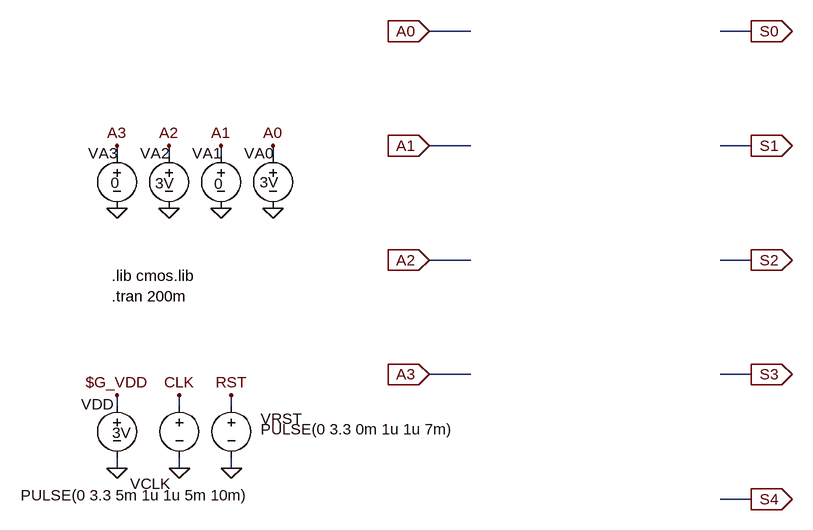
[diagram p0: schematic accumulator.asc]
accumulator.asc, the LTspice schematic file:
Version 4
SHEET 1 1492 1076
WIRE -304 -112 -368 -112
WIRE 128 -112 80 -112
WIRE -304 64 -368 64
WIRE 128 64 80 64
WIRE -848 80 -848 64
WIRE -768 80 -768 64
WIRE -688 80 -688 64
WIRE -608 80 -608 64
WIRE -304 240 -368 240
WIRE 128 240 80 240
WIRE -304 416 -368 416
WIRE 128 416 80 416
WIRE -848 464 -848 448
WIRE -752 464 -752 448
WIRE -672 464 -672 448
WIRE -848 560 -848 544
WIRE -752 560 -752 544
WIRE -672 560 -672 544
WIRE 128 608 80 608
FLAG -752 560 0
FLAG -672 560 0
FLAG -848 448 $G_VDD
FLAG -848 560 0
FLAG -768 160 0
FLAG -368 -112 A0
IOPIN -368 -112 In
FLAG -368 64 A1
IOPIN -368 64 In
FLAG -368 240 A2
IOPIN -368 240 In
FLAG -368 416 A3
IOPIN -368 416 In
FLAG 128 -112 S0
IOPIN 128 -112 Out
FLAG 128 64 S1
IOPIN 128 64 Out
FLAG 128 240 S2
IOPIN 128 240 Out
FLAG 128 416 S3
IOPIN 128 416 Out
FLAG 128 608 S4
IOPIN 128 608 Out
FLAG -848 160 0
FLAG -608 160 0
FLAG -688 160 0
FLAG -848 64 A3
FLAG -608 64 A0
FLAG -688 64 A1
FLAG -768 64 A2
FLAG -752 448 CLK
FLAG -672 448 RST
SYMBOL voltage -752 448 R0
WINDOW 123 0 0 Left 2
WINDOW 39 0 0 Left 2
WINDOW 3 107 154 Right 2
WINDOW 0 -76 136 Left 2
SYMATTR Value PULSE(0 3.3 5m 1u 1u 5m 10m)
SYMATTR InstName VCLK
SYMBOL voltage -672 448 R0
WINDOW 123 0 0 Left 2
WINDOW 39 0 0 Left 2
WINDOW 3 45 52 Left 2
WINDOW 0 45 36 Left 2
SYMATTR Value PULSE(0 3.3 0m 1u 1u 7m)
SYMATTR InstName VRST
SYMBOL voltage -848 448 R0
WINDOW 123 0 0 Left 2
WINDOW 39 0 0 Left 2
WINDOW 3 -7 58 Left 2
WINDOW 0 -55 14 Left 2
SYMATTR Value 3V
SYMATTR InstName VDD
SYMBOL voltage -768 64 R0
WINDOW 3 8 58 Right 2
WINDOW 123 0 0 Left 2
WINDOW 39 0 0 Left 2
WINDOW 0 -44 12 Left 2
SYMATTR Value 3V
SYMATTR InstName VA2
SYMBOL voltage -848 64 R0
WINDOW 3 4 57 Right 2
WINDOW 123 0 0 Left 2
WINDOW 39 0 0 Left 2
WINDOW 0 -44 12 Left 2
SYMATTR Value 0
SYMATTR InstName VA3
SYMBOL voltage -608 64 R0
WINDOW 3 9 56 Right 2
WINDOW 123 0 0 Left 2
WINDOW 39 0 0 Left 2
WINDOW 0 -44 12 Left 2
SYMATTR Value 3V
SYMATTR InstName VA0
SYMBOL voltage -688 64 R0
WINDOW 3 3 59 Right 2
WINDOW 123 0 0 Left 2
WINDOW 39 0 0 Left 2
WINDOW 0 -44 12 Left 2
SYMATTR Value 0
SYMATTR InstName VA1
TEXT -856 296 Left 2 !.tran 200m
TEXT -856 264 Left 2 !.lib cmos.lib

The netlist it stands for:
* accumulator.asc
VCLK CLK 0 PULSE(0 3.3 5m 1u 1u 5m 10m)
VRST RST 0 PULSE(0 3.3 0m 1u 1u 7m)
VDD $G_VDD 0 3V
VA2 A2 0 3V
VA3 A3 0 0
VA0 A0 0 3V
VA1 A1 0 0
.tran 200m
.lib cmos.lib
.backanno
.end